# Altium schematic sheet FPGA.SchDoc: ThunderScope 1000E
size A4; DrawnBy: Aleksa Bjelogrlic; Revision: 1
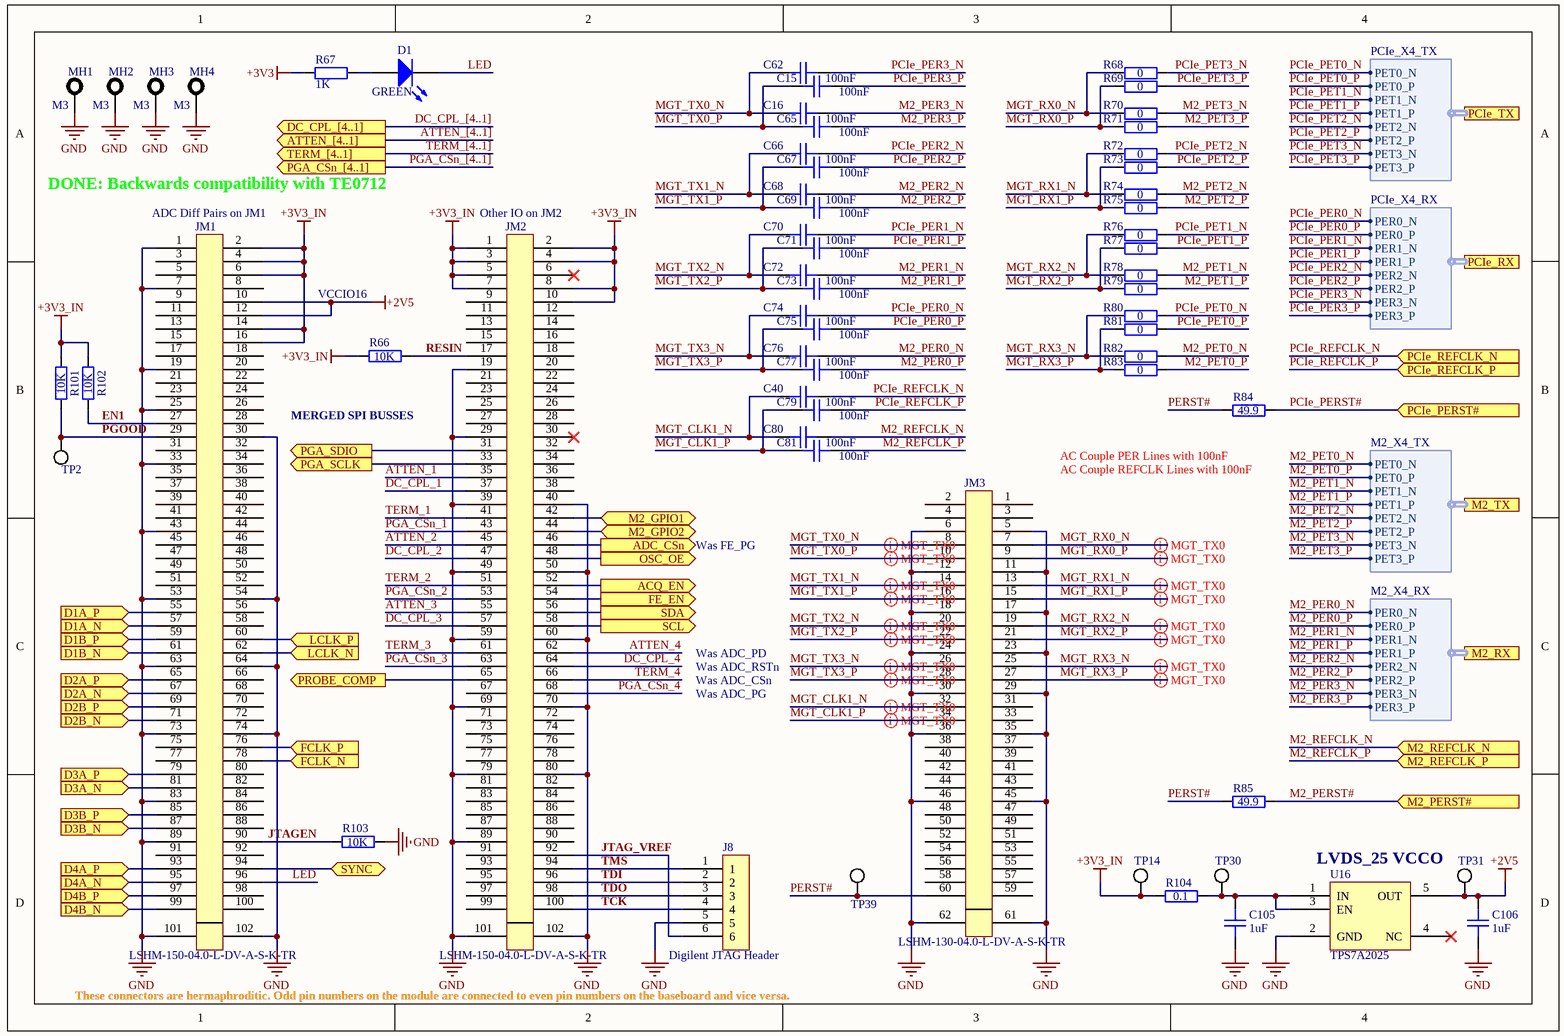
[diagram p0: FPGA.SchDoc]

## Parts
C15  100nF  [GEN_C_0201]
C16  100nF  [GEN_C_0201]
C40  100nF  [GEN_C_0201]
C62  100nF  [GEN_C_0201]
C65  100nF  [GEN_C_0201]
C66  100nF  [GEN_C_0201]
C67  100nF  [GEN_C_0201]
C68  100nF  [GEN_C_0201]
C69  100nF  [GEN_C_0201]
C70  100nF  [GEN_C_0201]
C71  100nF  [GEN_C_0201]
C72  100nF  [GEN_C_0201]
C73  100nF  [GEN_C_0201]
C74  100nF  [GEN_C_0201]
C75  100nF  [GEN_C_0201]
C76  100nF  [GEN_C_0201]
C77  100nF  [GEN_C_0201]
C79  100nF  [GEN_C_0201]
C80  100nF  [GEN_C_0201]
C81  100nF  [GEN_C_0201]
C105  1uF  [GEN_C_0402]
C106  1uF  [GEN_C_0402]
D1  GREEN  [LED_0603_LTST-S270K]
J8  2.54mm 6 Pin TH  [GEN_2.54mm_6_Pin_TH_RA]  (value not drawn)
JM1  LSHM-150-04.0-L-DV-A-S-K-TR  [SAM_LSHM-150-XX.X-XX-DV-A-S]
JM2  LSHM-150-04.0-L-DV-A-S-K-TR  [SAM_LSHM-150-XX.X-XX-DV-A-S]
JM3  LSHM-130-04.0-L-DV-A-S-K-TR  [SAM_LSHM-130-XX.X-XX-DV-A-S]
MH1  M3  [MH M3]  (no BOM)
MH2  M3  [MH M3]  (no BOM)
MH3  M3  [MH M3]  (no BOM)
MH4  M3  [MH M3]  (no BOM)
R66  10K  [GEN_R_0402]
R67  1K  [GEN_R_0402]
R68  0  [GEN_R_0201]
R69  0  [GEN_R_0201]
R70  0  [GEN_R_0201]
R71  0  [GEN_R_0201]
R72  0  [GEN_R_0201]
R73  0  [GEN_R_0201]
R74  0  [GEN_R_0201]
R75  0  [GEN_R_0201]
R76  0  [GEN_R_0201]
R77  0  [GEN_R_0201]
R78  0  [GEN_R_0201]
R79  0  [GEN_R_0201]
R80  0  [GEN_R_0201]
R81  0  [GEN_R_0201]
R82  0  [GEN_R_0201]
R83  0  [GEN_R_0201]
R84  49.9  [GEN_R_0402]
R85  49.9  [GEN_R_0402]
R101  10K  [GEN_R_0402]
R102  10K  [GEN_R_0402]
R103  10K  [GEN_R_0402]
R104  0.1  [GEN_R_0402]
TP2  PCB  [GEN_TP_PCB]  (value not drawn)  (no BOM)
TP14  PCB  [GEN_TP_PCB]  (value not drawn)  (no BOM)
TP30  PCB  [GEN_TP_PCB]  (value not drawn)  (no BOM)
TP31  PCB  [GEN_TP_PCB]  (value not drawn)  (no BOM)
TP39  PCB  [GEN_TP_PCB]  (value not drawn)  (no BOM)
U16  TPS7A2025  [GEN_SOT23_5_950_2900X1600X1450]

## Ports
ACQ_EN (out), ADC_CSn (out), ATTEN_[4..1] (out), D1A_N (in), D1A_P (in), D1B_N (in), D1B_P (in), D2A_N (in), D2A_P (in), D2B_N (in), D2B_P (in), D3A_N (in), D3A_P (in), D3B_N (in), D3B_P (in), D4A_N (in), D4A_P (in), D4B_N (in), D4B_P (in), DC_CPL_[4..1] (out), FCLK_N (in), FCLK_P (in), FE_EN (out), LCLK_N (in), LCLK_P (in), M2_GPIO1 (bidir), M2_GPIO2 (bidir), M2_PERST# (in), M2_REFCLK_N (in), M2_REFCLK_P (in), M2_RX (harness M2_X4_RX), M2_TX (harness M2_X4_TX), OSC_OE (out), PCIe_PERST# (in), PCIe_REFCLK_N (in), PCIe_REFCLK_P (in), PCIe_RX (harness PCIe_X4_RX), PCIe_TX (harness PCIe_X4_TX), PGA_CSn_[4..1] (out), PGA_SCLK (out), PGA_SDIO (out), PROBE_COMP (out), SCL (out), SDA (out), SYNC (bidir), TERM_[4..1] (out)

## Harnesses
PCIe_X4_RX: PER0_N, PER0_P, PER1_N, PER1_P, PER2_N, PER2_P, PER3_N, PER3_P
PCIe_X4_TX: PET0_N, PET0_P, PET1_N, PET1_P, PET2_N, PET2_P, PET3_N, PET3_P
M2_X4_RX: PER0_N, PER0_P, PER1_N, PER1_P, PER2_N, PER2_P, PER3_N, PER3_P
M2_X4_TX: PET0_N, PET0_P, PET1_N, PET1_P, PET2_N, PET2_P, PET3_N, PET3_P

## Nets
+2V5: C106.2 JM1.10 JM1.12 TP31.1 U16.5(OUT)
+3V3: R67.2
+3V3_IN: JM1.2 JM1.4 JM1.6 JM1.14 JM1.16 JM2.1 JM2.2 JM2.3 JM2.4 JM2.5 JM2.7 JM2.8 JM2.10 R66.2 R101.2 R102.2 R104.1 TP14.1
GND: C105.1 C106.1 J8.5 JM1.1 JM1.7 JM1.19 JM1.25 JM1.30 JM1.33 JM1.43 JM1.53 JM1.54 JM1.63 JM1.64 JM1.73 JM1.74 JM1.83 JM1.89 JM1.101 JM1.102 JM2.19 JM2.29 JM2.39 JM2.40 JM2.49 JM2.50 JM2.59 JM2.60 JM2.69 JM2.70 JM2.79 JM2.80 JM2.89 JM2.101 JM2.102 JM3.5 JM3.6 JM3.11 JM3.12 JM3.17 JM3.18 JM3.23 JM3.24 JM3.29 JM3.30 JM3.35 JM3.36 JM3.45 JM3.46 JM3.61 JM3.62 MH1.1 MH2.1 MH3.1 MH4.1 R103.1 U16.2(GND)
ACQ_EN: JM2.52 ; port ACQ_EN
ADC_CSn: JM2.46 ; port ADC_CSn
ATTEN_1: JM2.35
ATTEN_2: JM2.45
ATTEN_3: JM2.55
ATTEN_4: JM2.62
D1A_N: JM1.57 ; port D1A_N
D1A_P: JM1.55 ; port D1A_P
D1B_N: JM1.61 ; port D1B_N
D1B_P: JM1.59 ; port D1B_P
D2A_N: JM1.67 ; port D2A_N
D2A_P: JM1.65 ; port D2A_P
D2B_N: JM1.71 ; port D2B_N
D2B_P: JM1.69 ; port D2B_P
D3A_N: JM1.81 ; port D3A_N
D3A_P: JM1.79 ; port D3A_P
D3B_N: JM1.87 ; port D3B_N
D3B_P: JM1.85 ; port D3B_P
D4A_N: JM1.95 ; port D4A_N
D4A_P: JM1.93 ; port D4A_P
D4B_N: JM1.99 ; port D4B_N
D4B_P: JM1.97 ; port D4B_P
DC_CPL_1: JM2.37
DC_CPL_2: JM2.47
DC_CPL_3: JM2.57
DC_CPL_4: JM2.64
EN1: JM1.27 R102.1
FCLK_N: JM1.78 ; port FCLK_N
FCLK_P: JM1.76 ; port FCLK_P
FE_EN: JM2.54 ; port FE_EN
JTAG_VREF: J8.6 JM2.92
JTAGEN: JM1.90 R103.2
LCLK_N: JM1.62 ; port LCLK_N
LCLK_P: JM1.60 ; port LCLK_P
LED: D1.1(K) JM1.96
M2_GPIO1: JM2.42 ; port M2_GPIO1
M2_GPIO2: JM2.44 ; port M2_GPIO2
M2_PER0_N: C76.1 ; port M2_RX.PER0_N
M2_PER0_P: C77.1 ; port M2_RX.PER0_P
M2_PER1_N: C72.1 ; port M2_RX.PER1_N
M2_PER1_P: C73.1 ; port M2_RX.PER1_P
M2_PER2_N: C68.1 ; port M2_RX.PER2_N
M2_PER2_P: C69.1 ; port M2_RX.PER2_P
M2_PER3_N: C16.1 ; port M2_RX.PER3_N
M2_PER3_P: C65.1 ; port M2_RX.PER3_P
M2_PERST#: R85.2 ; port M2_PERST#
M2_PET0_N: R82.2 ; port M2_TX.PET0_N
M2_PET0_P: R83.2 ; port M2_TX.PET0_P
M2_PET1_N: R78.2 ; port M2_TX.PET1_N
M2_PET1_P: R79.2 ; port M2_TX.PET1_P
M2_PET2_N: R74.2 ; port M2_TX.PET2_N
M2_PET2_P: R75.2 ; port M2_TX.PET2_P
M2_PET3_N: R70.2 ; port M2_TX.PET3_N
M2_PET3_P: R71.2 ; port M2_TX.PET3_P
M2_REFCLK_N: C80.1 ; port M2_REFCLK_N
M2_REFCLK_P: C81.1 ; port M2_REFCLK_P
MGT_CLK1_N: C40.2 C80.2 JM3.32
MGT_CLK1_P: C79.2 C81.2 JM3.34
MGT_RX0_N: JM3.7 R68.1 R70.1
MGT_RX0_P: JM3.9 R69.1 R71.1
MGT_RX1_N: JM3.13 R72.1 R74.1
MGT_RX1_P: JM3.15 R73.1 R75.1
MGT_RX2_N: JM3.19 R76.1 R78.1
MGT_RX2_P: JM3.21 R77.1 R79.1
MGT_RX3_N: JM3.25 R80.1 R82.1
MGT_RX3_P: JM3.27 R81.1 R83.1
MGT_TX0_N: C16.2 C62.2 JM3.8
MGT_TX0_P: C15.2 C65.2 JM3.10
MGT_TX1_N: C66.2 C68.2 JM3.14
MGT_TX1_P: C67.2 C69.2 JM3.16
MGT_TX2_N: C70.2 C72.2 JM3.20
MGT_TX2_P: C71.2 C73.2 JM3.22
MGT_TX3_N: C74.2 C76.2 JM3.26
MGT_TX3_P: C75.2 C77.2 JM3.28
OSC_OE: JM2.48 ; port OSC_OE
PCIe_PER0_N: C74.1 ; port PCIe_RX.PER0_N
PCIe_PER0_P: C75.1 ; port PCIe_RX.PER0_P
PCIe_PER1_N: C70.1 ; port PCIe_RX.PER1_N
PCIe_PER1_P: C71.1 ; port PCIe_RX.PER1_P
PCIe_PER2_N: C66.1 ; port PCIe_RX.PER2_N
PCIe_PER2_P: C67.1 ; port PCIe_RX.PER2_P
PCIe_PER3_N: C62.1 ; port PCIe_RX.PER3_N
PCIe_PER3_P: C15.1 ; port PCIe_RX.PER3_P
PCIe_PERST#: R84.2 ; port PCIe_PERST#
PCIe_PET0_N: R80.2 ; port PCIe_TX.PET0_N
PCIe_PET0_P: R81.2 ; port PCIe_TX.PET0_P
PCIe_PET1_N: R76.2 ; port PCIe_TX.PET1_N
PCIe_PET1_P: R77.2 ; port PCIe_TX.PET1_P
PCIe_PET2_N: R72.2 ; port PCIe_TX.PET2_N
PCIe_PET2_P: R73.2 ; port PCIe_TX.PET2_P
PCIe_PET3_N: R68.2 ; port PCIe_TX.PET3_N
PCIe_PET3_P: R69.2 ; port PCIe_TX.PET3_P
PCIe_REFCLK_N: C40.1 ; port PCIe_REFCLK_N
PCIe_REFCLK_P: C79.1 ; port PCIe_REFCLK_P
PERST#: JM3.60 R84.1 R85.1 TP39.1
PGA_CSn_1: JM2.43
PGA_CSn_2: JM2.53
PGA_CSn_3: JM2.63
PGA_CSn_4: JM2.68
PGA_SCLK: JM2.33 ; port PGA_SCLK
PGA_SDIO: JM2.31 ; port PGA_SDIO
PGOOD: JM1.29 R101.1 TP2.1
PROBE_COMP: JM2.65 ; port PROBE_COMP
RESIN: JM2.17 R66.1
SCL: JM2.58 ; port SCL
SDA: JM2.56 ; port SDA
SYNC: JM1.94 ; port SYNC
TCK: J8.4 JM2.100
TDI: J8.2 JM2.96
TDO: J8.3 JM2.98
TERM_1: JM2.41
TERM_2: JM2.51
TERM_3: JM2.61
TERM_4: JM2.66
TMS: J8.1 JM2.94
NetC105_2: C105.2 R104.2 TP30.1 U16.1(IN) U16.3(EN)
NetD1_2: D1.2(A) R67.1

Not connected (* = marked no-connect by the designer): JM1 3 5 8 9 11 13 15 17 18 20 21 22 23 24 26 28 31 32 34 35 36 37 38 39 40 41 42 44 45 46 47 48 49 50 51 52 56 58 66 68 70 72 75 77 80 82 84 86 88 91 92 98 100; JM2 6* 9 11 12 13 14 15 16 18 20 21 22 23 24 25 26 27 28 30* 32 34 36 38 67 71 72 73 74 75 76 77 78 81 82 83 84 85 86 87 88 90 91 93 95 97 99; JM3 1 2 3 4 31 33 37 38 39 40 41 42 43 44 47 48 49 50 51 52 53 54 55 56 57 58 59; U16 4(NC)*

## Buses and harness runs
bus ATTEN_[4..1] = port ATTEN_[4..1]
bus DC_CPL_[4..1] = port DC_CPL_[4..1]
bus PGA_CSn_[4..1] = port PGA_CSn_[4..1]
bus TERM_[4..1] = port TERM_[4..1]

## Layout directives
differential pair; differential pair class PCIe: MGT_CLK1_N, MGT_CLK1_P, MGT_RX0_N, MGT_RX0_P, MGT_RX1_N, MGT_RX1_P, MGT_RX2_N, MGT_RX2_P, MGT_RX3_N, MGT_RX3_P, MGT_TX0_N, MGT_TX0_P, MGT_TX1_N, MGT_TX1_P, MGT_TX2_N, MGT_TX2_P, MGT_TX3_N, MGT_TX3_P

## Notes on the sheet
- DONE: Backwards compatibility with TE0712
- (near JM1) ADC Diff Pairs on JM1
- (near JM2) Other IO on JM2
- VCCIO16
- MERGED SPI BUSSES
- (near R84) AC Couple PER Lines with 100nF
- AC Couple REFCLK Lines with 100nF
- Was FE_PG
- Was ADC_PD
- Was ADC_RSTn
- Was ADC_PG
- Was ADC_CSn
- (near U16) LVDS_25 VCCO
- (near J8) Digilent JTAG Header
- These connectors are hermaphroditic. Odd pin numbers on the module are connected to even pin numbers on the baseboard and vice versa.

## Library data of the parts
C15 C16 C40 C62 C65-C77 C79-C81 = CAP 100nF 6.3V X5R 0201: Voltage Rating: 6.3V; Package: 0201; Supplier 1: Digi-Key; Supplier Part Number 1: 490-3167-1-ND; Value: 100nF
C105 C106 = CAP 1uF 25V X5R 0402: Voltage Rating: 25V; Package: 0402; Supplier 1: Digi-Key; Supplier Part Number 1: 490-10017-1-ND; Value: 1uF
D1 = LED GREEN 0603 LTST-S270K: Supplier 1: Digi-Key; Supplier Part Number 1: 160-1478-1-ND
J8 = CONN 2.54mm 6 Pin TH RA: Supplier 1: Digi-Key; Supplier Part Number 1: 732-5339-ND
JM1 JM2 = CONN LSHM-150-04.0-L-DV-A-S-K-TR: Supplier 1: Digi-Key; Supplier Part Number 1: SAM9033CT-ND
JM3 = CONN LSHM-130-04.0-L-DV-A-S-K-TR: Supplier 1: Digi-Key; Supplier Part Number 1: SAM9034CT-ND
MH1-MH4 = MH M3
R66 R101-R103 = RES 10K OHM 1% 1/10W 0402: Tolerance: 1%; Power Rating: 0.1W; Package: 0402; Supplier 1: Digi-Key; Supplier Part Number 1: P10.0KLCT-ND; Value: 10K
R67 = RES 1K OHM 1% 1/10W 0402: Tolerance: 1%; Power Rating: 0.1W; Package: 0402; Supplier 1: Digi-Key; Supplier Part Number 1: 311-1.00KLRCT-ND; Value: 1K
R68-R83 = RES 0 OHM 1% 1/20W 0201: Power Rating: 0.05W; Tolerance: 1%; Package: 0201; Supplier 1: Digi-Key; Supplier Part Number 1: RMCF0201ZT0R00CT-ND; Value: 0
R84 R85 = RES 49.9 OHM 1% 1/10W 0402: Tolerance: 1%; Power Rating: 0.1W; Package: 0402; Supplier 1: Digi-Key; Supplier Part Number 1: 311-49.9LRCT-ND; Value: 49.9
R104 = RES 0.1 OHM 1% 1/6W 0402: Tolerance: 1%; Power Rating: 0.16W; Package: 0402; Supplier 1: Digi-Key; Supplier Part Number 1: P.10AKCT-ND; Value: 0.1
TP2 TP14 TP30 TP31 TP39 = TP PCB 1mm
U16 = IC LDO TPS7A2025: Supplier 1: Digi-Key; Supplier Part Number 1: 296-TPS7A2025PDBVRCT-ND